# Altium schematic sheet ICtest.SchDoc
size A4
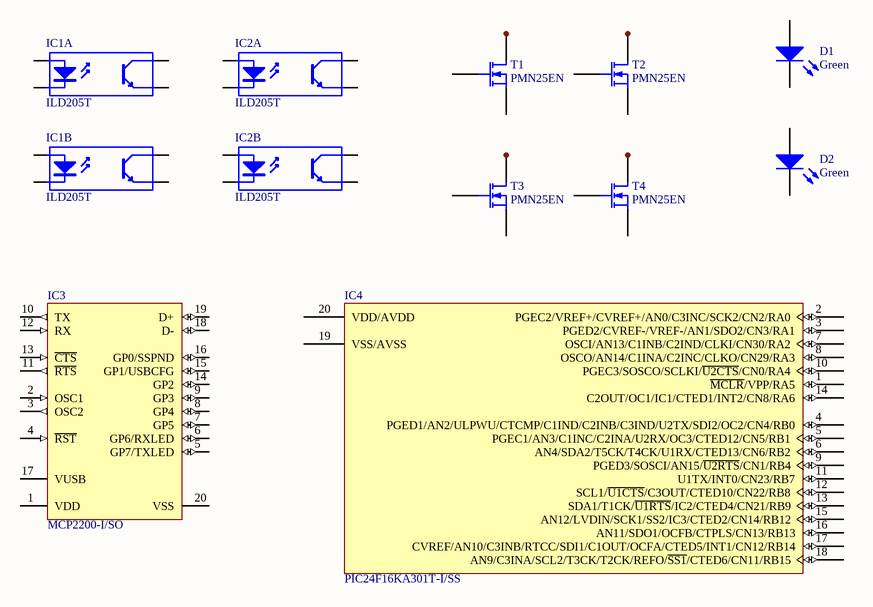
[diagram p0: ICtest.SchDoc]

## Parts
D1  Green  [LED-GREEN-0603]
D2  Green  [LED-GREEN-0603]
IC1  ILD205T  [IC-SOIC-8]  (parts A,B of 2)
IC2  ILD205T  [IC-SOIC-8]  (parts A,B of 2)
IC3  MCP2200-I/SO  [IC-SOIC-20]
IC4  PIC24F16KA301T-I/SS  [IC-TSSOP-20]
T1  PMN25EN  [IC-TSOT-6]
T2  PMN25EN  [IC-TSOT-6]
T3  PMN25EN  [IC-TSOT-6]
T4  PMN25EN  [IC-TSOT-6]

## Nets
NetT1_1: T1.1(D) T1.2(D) T1.5(D) T1.6(D)
NetT2_1: T2.1(D) T2.2(D) T2.5(D) T2.6(D)
NetT3_1: T3.1(D) T3.2(D) T3.5(D) T3.6(D)
NetT4_1: T4.1(D) T4.2(D) T4.5(D) T4.6(D)

Not connected (* = marked no-connect by the designer): D1 1(A) 2(K); D2 1(A) 2(K); IC1 1(A) 2(C) 3(A) 4(C) 5(E) 6(C) 7(E) 8(C); IC2 1(A) 2(C) 3(A) 4(C) 5(E) 6(C) 7(E) 8(C); IC3 1(VDD) 2(OSC1) 3(OSC2) 4(~{RST}) 5(GP7/TXLED) 6(GP6/RXLED) 7(GP5) 8(GP4) 9(GP3) 10(TX) 11(~{RTS}) 12(RX) 13(~{CTS}) 14(GP2) 15(GP1/USBCFG) 16(GP0/SSPND) 17(VUSB) 18(D-) 19(D+) 20(VSS); IC4 1(~{MCLR}/VPP/RA5) 2(PGEC2/VREF+/CVREF+/AN0/C3INC/SCK2/CN2/RA0) 3(PGED2/CVREF-/VREF-/AN1/SDO2/CN3/RA1) 4(PGED1/AN2/ULPWU/CTCMP/C1IND/C2INB/C3IND/U2TX/SDI2/OC2/CN4/RB0) 5(PGEC1/AN3/C1INC/C2INA/U2RX/OC3/CTED12/CN5/RB1) 6(AN4/SDA2/T5CK/T4CK/U1RX/CTED13/CN6/RB2) 7(OSCI/AN13/C1INB/C2IND/CLKI/CN30/RA2) 8(OSCO/AN14/C1INA/C2INC/CLKO/CN29/RA3) 9(PGED3/SOSCI/AN15/~{U2RTS}/CN1/RB4) 10(PGEC3/SOSCO/SCLKI/~{U2CTS}/CN0/RA4) 11(U1TX/INT0/CN23/RB7) 12(SCL1/~{U1CTS}/C3OUT/CTED10/CN22/RB8) 13(SDA1/T1CK/~{U1RTS}/IC2/CTED4/CN21/RB9) 14(C2OUT/OC1/IC1/CTED1/INT2/CN8/RA6) 15(AN12/LVDIN/SCK1/SS2/IC3/CTED2/CN14/RB12) 16(AN11/SDO1/OCFB/CTPLS/CN13/RB13) 17(CVREF/AN10/C3INB/RTCC/SDI1/C1OUT/OCFA/CTED5/INT1/CN12/RB14) 18(AN9/C3INA/SCL2/T3CK/T2CK/REFO/~{SS1}/CTED6/CN11/RB15) 19(VSS/AVSS) 20(VDD/AVDD); T1 3(G) 4(S); T2 3(G) 4(S); T3 3(G) 4(S); T4 3(G) 4(S)

## Library data of the parts
D1 D2 = LED0: Typical INFRARED GaAs LED; Published: 8-Jun-2000; LatestRevisionDate: 08-Jul-2005; LatestRevisionNote: Mech Layer 1 removed.; PackageReference: LED-0; Publisher: Altium Limited; PackageDescription: LED; 2 Leads
IC1 IC2 = ILD205T: Optocoupler, Phototransistor Output, Dual Channel; Manufacturer: Vishay Semiconductor; OrderCode: 1469512; PartNumber: ILD205T; Supplier: Farnell; Technology: SMD; Package: SOIC-8; Datasheet: http://www.vishay.com/docs/83647/ild205t.pdf; SupplierLink: http://be.farnell.com/vishay-semiconductor/ild205t/optocoupler-transistor-o-p/dp/1469512
IC3 = CMP-0186-00205-1: USB 2.0 to UART Protocol Converter with GPIO, 20-Pin SOIC, Industrial Temperature; Manufacturer: Microchip; OrderCode: 1781148; ComponentLink1Description: Manufacturer URL; ComponentLink2URL: http://ww1.microchip.com/downloads/en/DeviceDoc/22228B.pdf; ComponentLink2Description: Datasheet; PackageDescription: 20-Lead Plastic Small Outline (SO) - Wide 7.50mm Body [SOIC]; ComponentLink3URL: http://www.microchip.com/stellent/groups/techpub_sg/documents/packagingspec/en012702.pdf; DatasheetVersion: revB, Mar-2011; PackageVersion: revBB, Aug-2009; PackageReference: SOIC-SO20; Code_IPC: SOIC127P1030-20; ComponentLink3Description: Package Specification; Code_JEDEC: MS-013-AC; ComponentLink1URL: http://www.microchip.com/; Supplier: Farnell; PartNumber: MCP2200-I/SO; SupplierLink: http://be.farnell.com/microchip/mcp2200-i-so/ic-usb2-0-to-uart-w-gpio-20soic/dp/1781148; Datasheet: http://www.farnell.com/datasheets/1481574.pdf
IC4 = CMP-0046-00392-1: 16-Bit Flash Microcontroller with XLP Technology, 16KB Flash, 2KB SRAM, 20-Pin SSOP, Industrial Temperature, Tape and Reel; Manufacturer: Microchip; OrderCode: 1898794; DatasheetVersion: revB, Apr-2011; Code_JEDEC: MO-150; ComponentLink3Description: Microchip.com Home; ComponentLink2Description: Packaging Specification; ComponentLink2URL: http://www.microchip.com/stellent/groups/techpub_sg/documents/packagingspec/en012702.pdf; ComponentLink3URL: http://www.microchip.com/; PackageDescription: 20-Lead Plastic Shrink Small Outline (SS) - 5.3mm Body [SSOP]; PackageReference: SSOP-SS20; ComponentLink1URL: http://ww1.microchip.com/downloads/en/DeviceDoc/39995_b.pdf; PackageVersion: revBB, Aug-2009; ComponentLink1Description: Datasheet; Supplier: Farnell; SupplierLink: http://be.farnell.com/microchip/pic24f16ka301-i-ss/mcu-16bit-pic24-32mhz-ssop-20/dp/1898794; PartNumber: PIC24F16KA301T-I/SS
T1-T4 = PMN25EN: 30V, 6.2A, N-channel Trench MOSFET; Manufacturer: NXP; OrderCode: 2069560; Datasheet: http://www.farnell.com/datasheets/1508382.pdf; Supplier: Farnell; SupplierLink: http://be.farnell.com/nxp/pmn25en/mosfet-n-ch-30v-6-2a-sot457/dp/2069560; Package: TSSOP-6; Technology: SMD